# EAGLE design layer4 (EAGLE 9.6.2)

## Sheet 1 of 2: Sensors
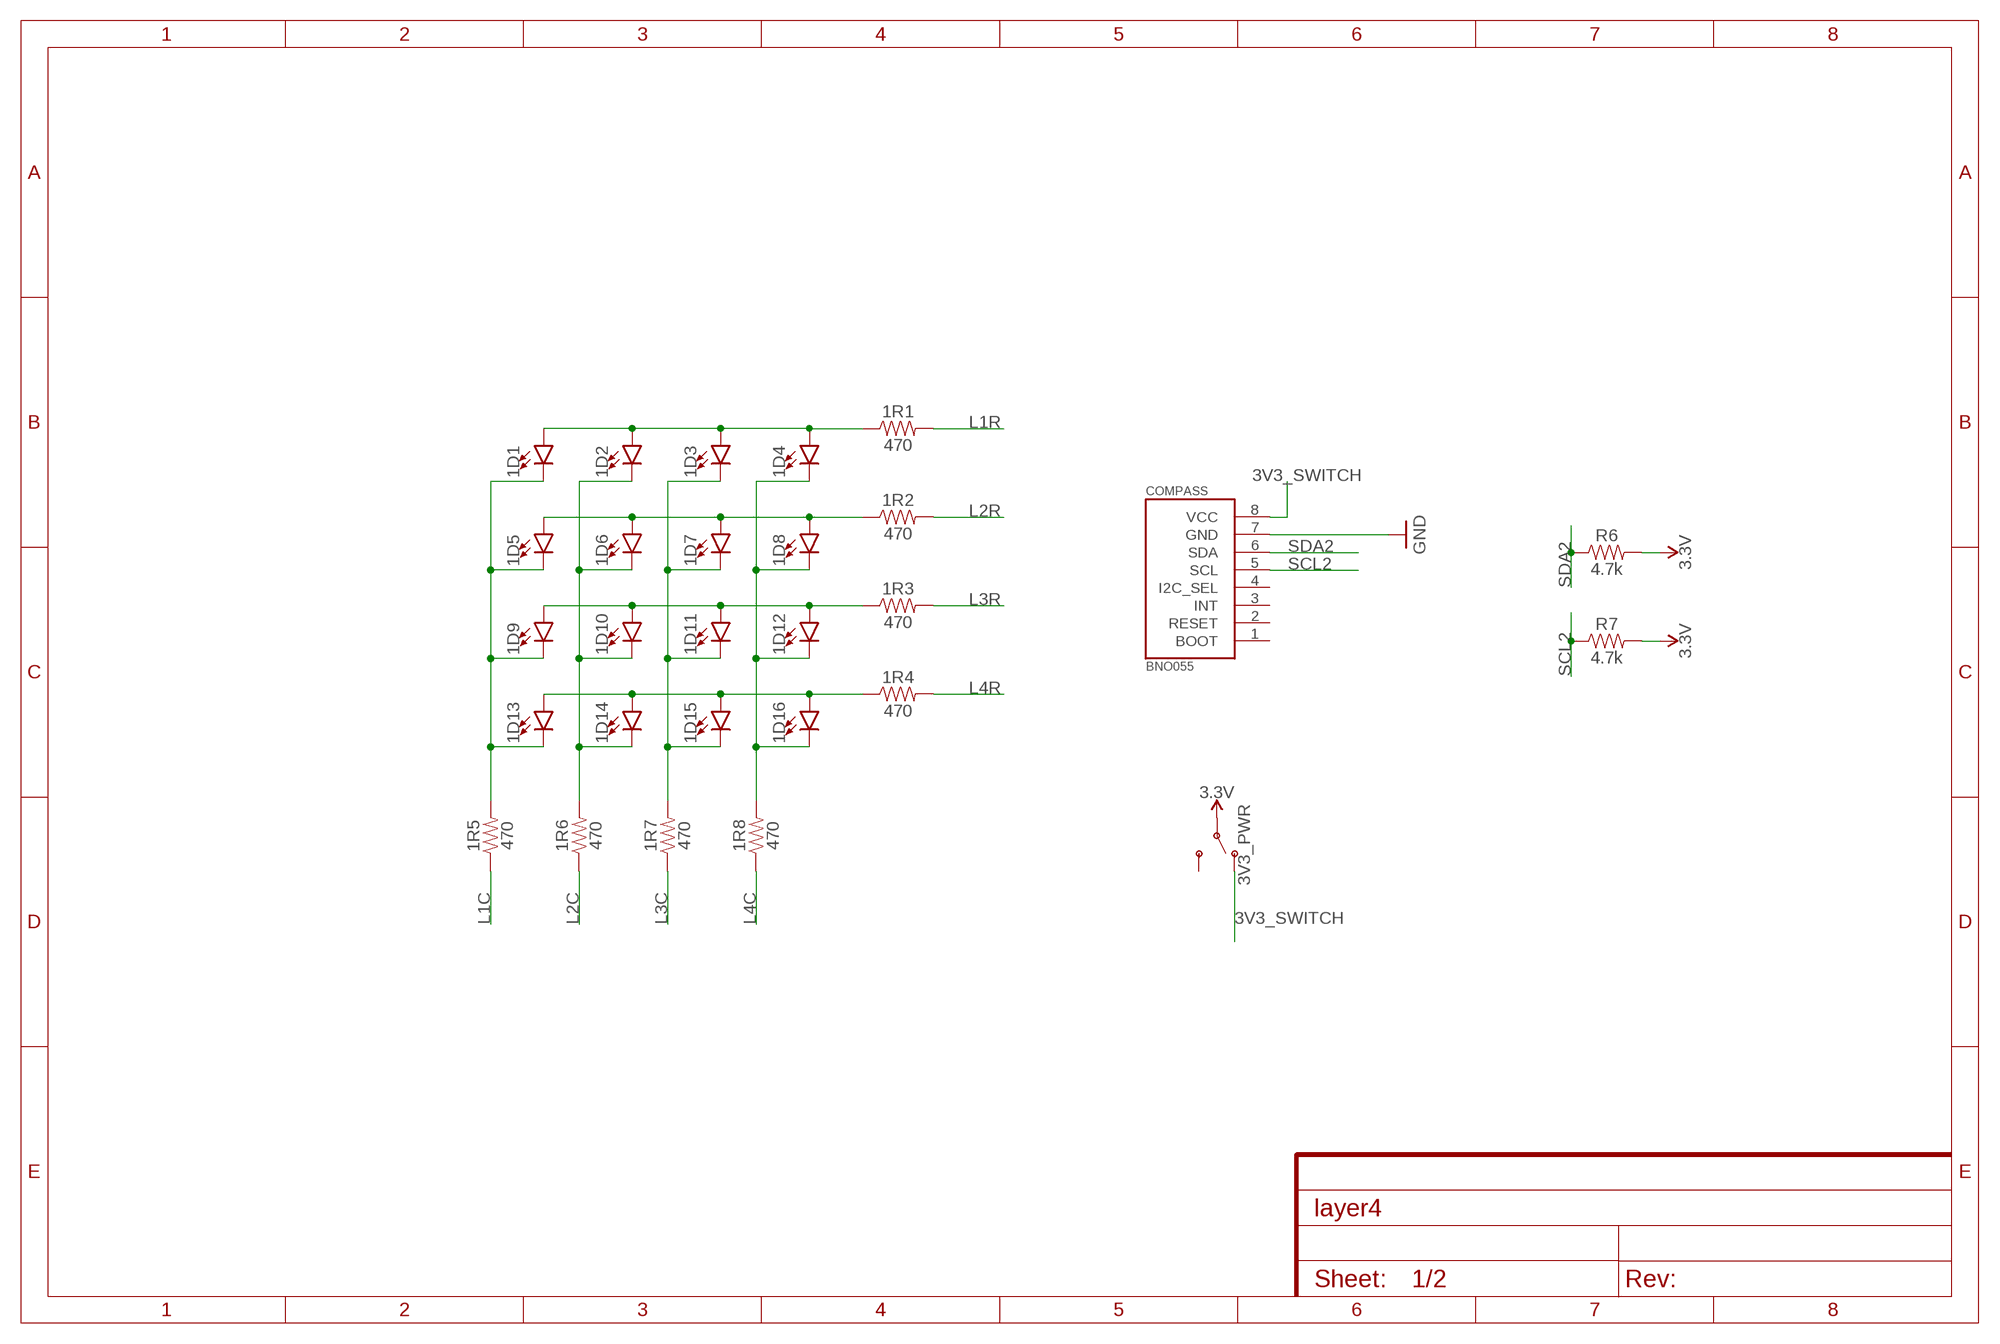
[diagram p0: schematic, sheet 1]

### Parts
1D1  LED0603  [LED-0603]
1D2  LED0603  [LED-0603]
1D3  LED0603  [LED-0603]
1D4  LED0603  [LED-0603]
1D5  LED0603  [LED-0603]
1D6  LED0603  [LED-0603]
1D7  LED0603  [LED-0603]
1D8  LED0603  [LED-0603]
1D9  LED0603  [LED-0603]
1D10  LED0603  [LED-0603]
1D11  LED0603  [LED-0603]
1D12  LED0603  [LED-0603]
1D13  LED0603  [LED-0603]
1D14  LED0603  [LED-0603]
1D15  LED0603  [LED-0603]
1D16  LED0603  [LED-0603]
1R1  470  RESISTOR0603  [R0603]
1R2  470  RESISTOR0603  [R0603]
1R3  470  RESISTOR0603  [R0603]
1R4  470  RESISTOR0603  [R0603]
1R5  470  RESISTOR0603  [R0603]
1R6  470  RESISTOR0603  [R0603]
1R7  470  RESISTOR0603  [R0603]
1R8  470  RESISTOR0603  [R0603]
3V3_PWR  SWITCH-SPDT-PTH-11.6X4.0MM-LOCK  [SWITCH_SPDT_PTH_11.6X4.0MM_LOCK]
COMPASS  BNO055  [BNO055]
R6  4.7k  4.7KOHM-0603-1/10W-1%  [0603]
R7  4.7k  4.7KOHM-0603-1/10W-1%  [0603]

### Nets
3.3V: 3V3_PWR.2(P) R6.2 R7.2 ; also sheet 2
3V3_SWITCH: 3V3_PWR.1(O) COMPASS.8(VCC) ; also sheet 2
GND: COMPASS.7(GND) ; also sheet 2
L1C: 1R5.1 ; also sheet 2
L1R: 1R1.2 ; also sheet 2
L2C: 1R6.1 ; also sheet 2
L2R: 1R2.2 ; also sheet 2
L3C: 1R7.1 ; also sheet 2
L3R: 1R3.2 ; also sheet 2
L4C: 1R8.1 ; also sheet 2
L4R: 1R4.2 ; also sheet 2
N$9: 1D1.A 1D2.A 1D3.A 1D4.A 1R1.1
N$11: 1D1.C 1D5.C 1D9.C 1D13.C 1R5.2
N$19: 1D5.A 1D6.A 1D7.A 1D8.A 1R2.1
N$20: 1D9.A 1D10.A 1D11.A 1D12.A 1R3.1
N$21: 1D13.A 1D14.A 1D15.A 1D16.A 1R4.1
N$22: 1D2.C 1D6.C 1D10.C 1D14.C 1R6.2
N$23: 1D3.C 1D7.C 1D11.C 1D15.C 1R7.2
N$24: 1D4.C 1D8.C 1D12.C 1D16.C 1R8.2
SCL2: COMPASS.5(SCL) R7.1 ; also sheet 2
SDA2: COMPASS.6(SDA) R6.1 ; also sheet 2
Unconnected: 3V3_PWR.3(S) COMPASS.1(BOOT) COMPASS.2(RESET) COMPASS.3(INT) COMPASS.4(I2C_SEL)

## Sheet 2 of 2: STEM32
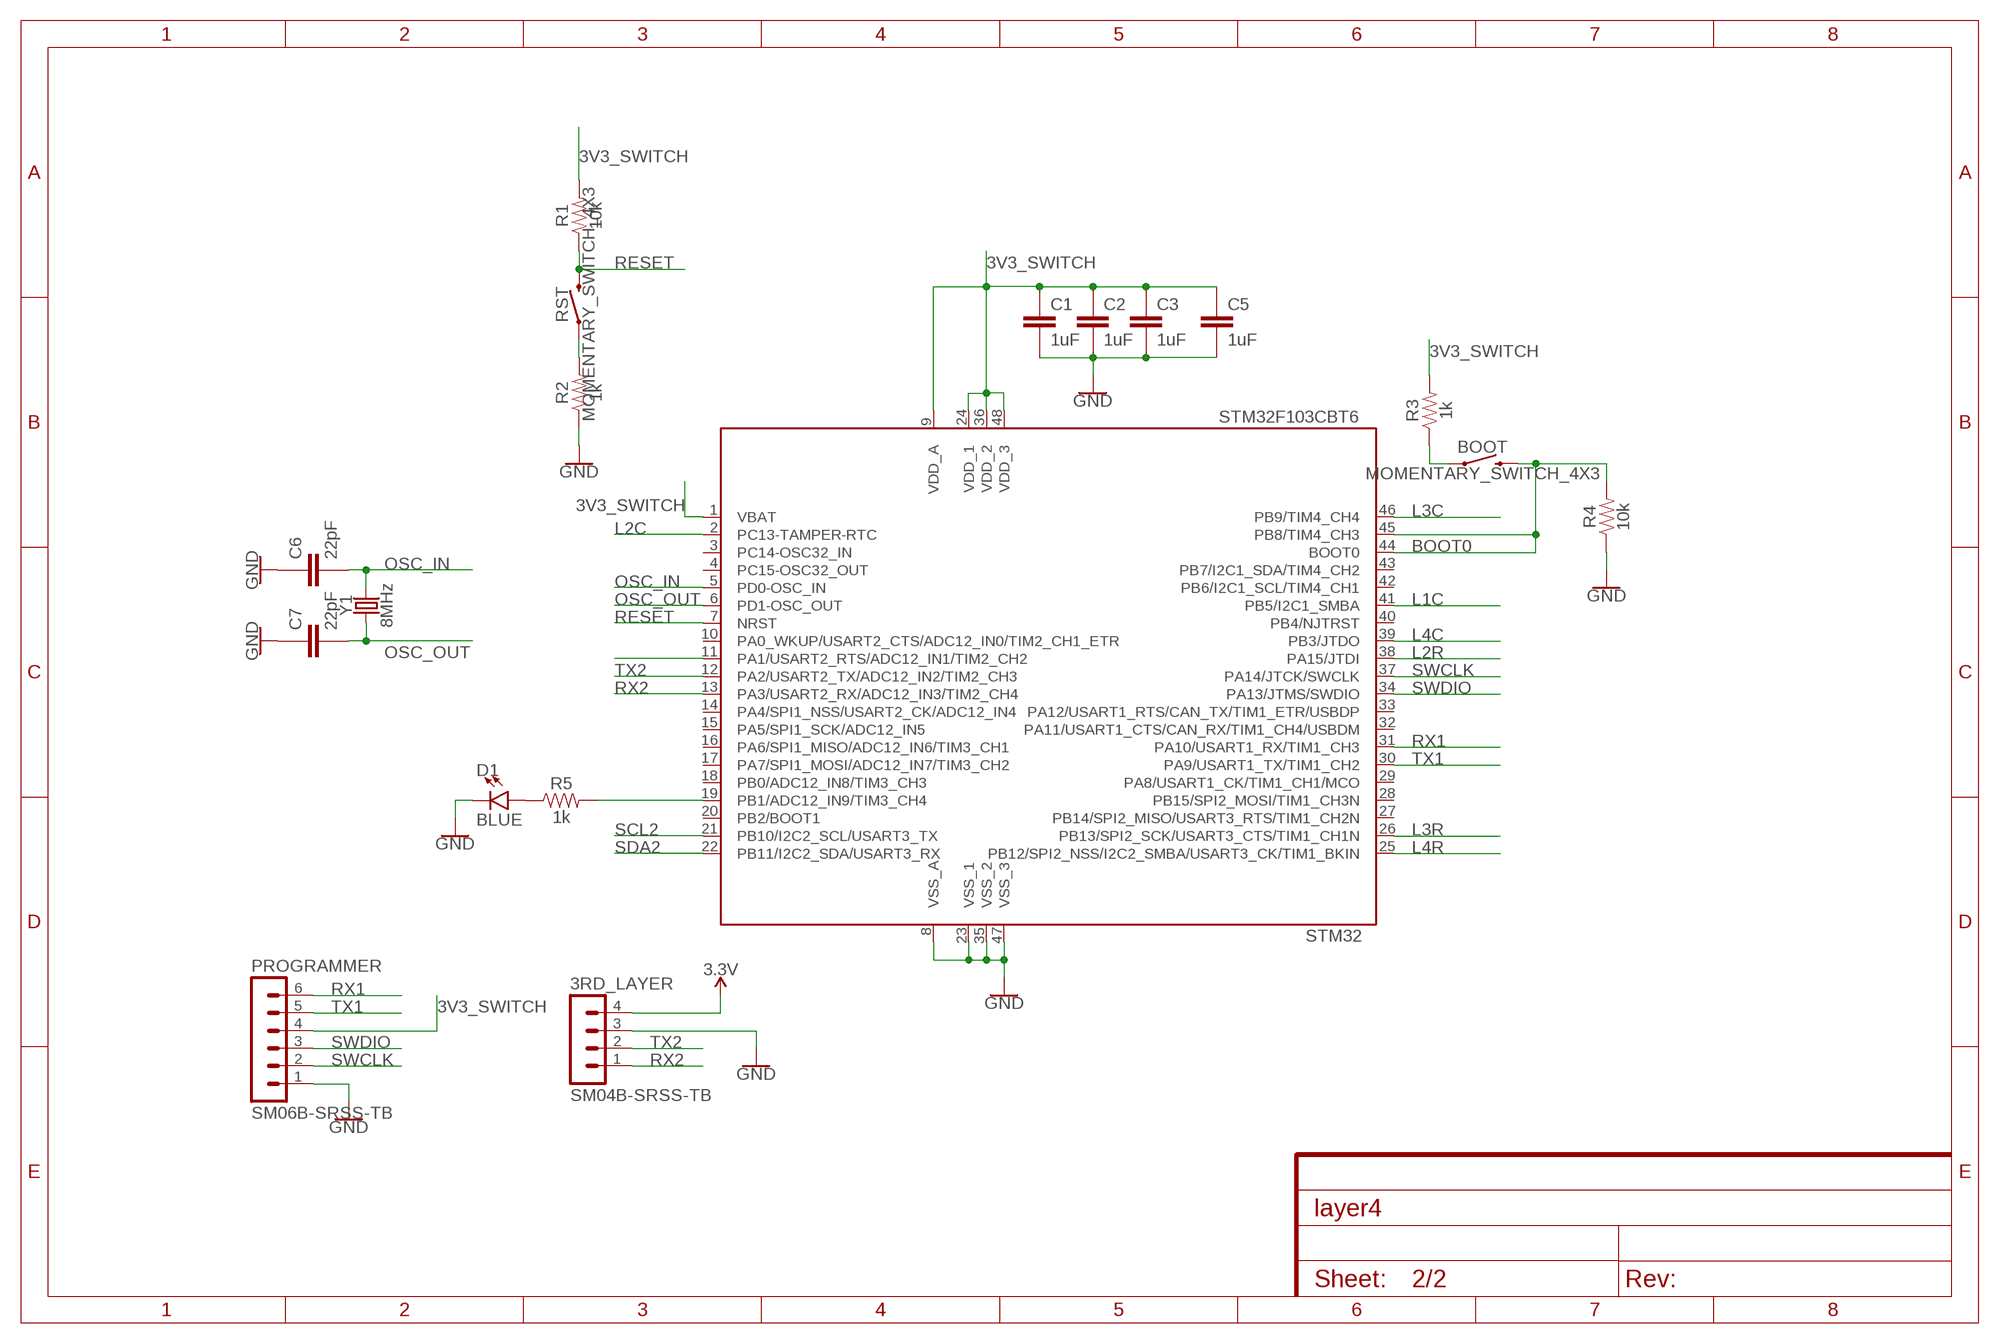
[diagram p1: schematic, sheet 2]

### Parts
3RD_LAYER  SM04B-SRSS-TB  [SM04B-SRSS-TB]
BOOT  MOMENTARY_SWITCH_4X3  [MOMENTARY_SWITCH_4X3]
C1  1uF  CAPACITOR0603  [C0603]
C2  1uF  CAPACITOR0603  [C0603]
C3  1uF  CAPACITOR0603  [C0603]
C5  1uF  CAPACITOR0603  [C0603]
C6  22pF  CAPACITOR0603  [C0603]
C7  22pF  CAPACITOR0603  [C0603]
D1  BLUE  LED0603  [LED-0603]
PROGRAMMER  SM06B-SRSS-TB  [SM06B-SRSS-TB]
R1  10k  RESISTOR0603  [R0603]
R2  1k  RESISTOR0603  [R0603]
R3  1k  RESISTOR0603  [R0603]
R4  10k  RESISTOR0603  [R0603]
R5  1k  RESISTOR0603  [R0603]
RST  MOMENTARY_SWITCH_4X3  [MOMENTARY_SWITCH_4X3]
STM32  STM32F103CBT6  [LQFP48]
Y1  8MHz  CRYSTALSMD-5X3.2-2PAD  [CRYSTAL-SMD-5X3.2-2PAD]

### Nets
3.3V: 3RD_LAYER.4 ; also sheet 1
3V3_SWITCH: C1.1 C2.1 C3.1 C5.2 PROGRAMMER.4 R1.2 R3.2 STM32.1(VBAT) STM32.9(VDD_A) STM32.24(VDD_1) STM32.36(VDD_2) STM32.48(VDD_3) ; also sheet 1
BOOT0: BOOT.P$2 R4.2 STM32.44(BOOT0) STM32.45(PB8/TIM4_CH3)
GND: 3RD_LAYER.3 C1.2 C2.2 C3.2 C5.1 C6.1 C7.1 D1.C PROGRAMMER.1 R2.1 R4.1 STM32.8(VSS_A) STM32.23(VSS_1) STM32.35(VSS_2) STM32.47(VSS_3) ; also sheet 1
L1C: STM32.41(PB5/I2C1_SMBA) ; also sheet 1
L1R: STM32.11(PA1/USART2_RTS/ADC12_IN1/TIM2_CH2) ; also sheet 1
L2C: STM32.2(PC13-TAMPER-RTC) ; also sheet 1
L2R: STM32.38(PA15/JTDI) ; also sheet 1
L3C: STM32.46(PB9/TIM4_CH4) ; also sheet 1
L3R: STM32.26(PB13/SPI2_SCK/USART3_CTS/TIM1_CH1N) ; also sheet 1
L4C: STM32.39(PB3/JTDO) ; also sheet 1
L4R: STM32.25(PB12/SPI2_NSS/I2C2_SMBA/USART3_CK/TIM1_BKIN) ; also sheet 1
N$70: R2.2 RST.P$1
N$72: BOOT.P$1 R3.1
N$73: R5.2 STM32.19(PB1/ADC12_IN9/TIM3_CH4)
N$74: D1.A R5.1
OSC_IN: C6.2 STM32.5(PD0-OSC_IN) Y1.P$2
OSC_OUT: C7.2 STM32.6(PD1-OSC_OUT) Y1.P$1
RESET: R1.1 RST.P$2 STM32.7(NRST)
RX1: PROGRAMMER.6 STM32.31(PA10/USART1_RX/TIM1_CH3)
RX2: 3RD_LAYER.1 STM32.13(PA3/USART2_RX/ADC12_IN3/TIM2_CH4)
SCL2: STM32.21(PB10/I2C2_SCL/USART3_TX) ; also sheet 1
SDA2: STM32.22(PB11/I2C2_SDA/USART3_RX) ; also sheet 1
SWCLK: PROGRAMMER.2 STM32.37(PA14/JTCK/SWCLK)
SWDIO: PROGRAMMER.3 STM32.34(PA13/JTMS/SWDIO)
TX1: PROGRAMMER.5 STM32.30(PA9/USART1_TX/TIM1_CH2)
TX2: 3RD_LAYER.2 STM32.12(PA2/USART2_TX/ADC12_IN2/TIM2_CH3)
Unconnected: STM32.3(PC14-OSC32_IN) STM32.4(PC15-OSC32_OUT) STM32.10(PA0_WKUP/USART2_CTS/ADC12_IN0/TIM2_CH1_ETR) STM32.14(PA4/SPI1_NSS/USART2_CK/ADC12_IN4) STM32.15(PA5/SPI1_SCK/ADC12_IN5) STM32.16(PA6/SPI1_MISO/ADC12_IN6/TIM3_CH1) STM32.17(PA7/SPI1_MOSI/ADC12_IN7/TIM3_CH2) STM32.18(PB0/ADC12_IN8/TIM3_CH3) STM32.20(PB2/BOOT1) STM32.27(PB14/SPI2_MISO/USART3_RTS/TIM1_CH2N) STM32.28(PB15/SPI2_MOSI/TIM1_CH3N) STM32.29(PA8/USART1_CK/TIM1_CH1/MCO) STM32.32(PA11/USART1_CTS/CAN_RX/TIM1_CH4/USBDM) STM32.33(PA12/USART1_RTS/CAN_TX/TIM1_ETR/USBDP) STM32.40(PB4/NJTRST) STM32.42(PB6/I2C1_SCL/TIM4_CH1) STM32.43(PB7/I2C1_SDA/TIM4_CH2)

## Library data of the parts
1D1-1D16 D1 = SparkFun-LED:LED: LED (Generic) Standard schematic elements and footprints for 5mm, 3mm, 1206, and 0603 sized LEDs. Generic LEDs with no color specified.
1R1-1R8 R1-R5 = JH:RESISTOR
3RD_LAYER = con-JST SH:SM04B-SRSS: JST SH series header 1.00mm pitch disconnectable crimp style connectors, horizontal (side entry type), 4 pins
3V3_PWR = SparkFun-Switches:SWITCH-SPDT: Single Pole, Double Throw (SPDT) Switch Single-pole, double-throw (SPDT) switch. Variant Overview SMD-AYZ0202 Surface Mount DPDT Switch <https://www.sparkfun.com/products/597> (COM-00597) Used on e.g. LilyPad Arduino USB - ATmega32U4 Board <https://www.sparkfun.com/products/12049> PTH-11.6X4.0MM SPDT Mini Power Switch <https://www.sparkfun.com/products/102> (COM-00102) Used on e.g. SparkFun Simon Says - Through-Hole Soldering Kit <https://www.sparkfun.com/products/10547> (KIT-10547) PTH-11.6X4.0MM-KIT KIT version of SPDT Mini Power Switch - Simplifies soldering by removing tStop of switch pins - only one side can be soldered. PTH-11.6X4.0MM-LOCK LOCK version of SPDT Mini Power Switch - Offset pins hold switch in place for easier soldering. SMD-RIGHT-ANGLE Surface Mount Right Angle Switch <https://www.sparkfun.com/products/10860> (COM-10860) Used on e.g. SparkFun ESP8266 Thing <https://www.sparkfun.com/products/13231>; PROD_ID: SWCH-08261; SF_SKU: COM-00102
BOOT RST = MY-LIBRARY:MOMENTARY_SWITCH_4X3
C1-C3 C5-C7 = JH:CAPACITOR
COMPASS = JH:BNO055
PROGRAMMER = con-JST SH:SM06B-SRSS: JST SH series header 1.00mm pitch disconnectable crimp style connectors, horizontal (side entry type), 6 pins
R6 R7 = SparkFun-Resistors:4.7KOHM: 4.7kΩ resistor A resistor is a passive two-terminal electrical component that implements electrical resistance as a circuit element. Resistors act to reduce current flow, and, at the same time, act to lower voltage levels within circuits. - Wikipedia; PROD_ID: RES-07857
STM32 = JH:STM32F103CBT6
Y1 = SparkFun-Clocks:CRYSTAL: Crystals (Generic) These are passive quartz crystals, which can be used as a clock source for a microcontroller. Crystal's are two-terminal devices. They require external "load" capacitors to generate an oscillating signal.

## Board
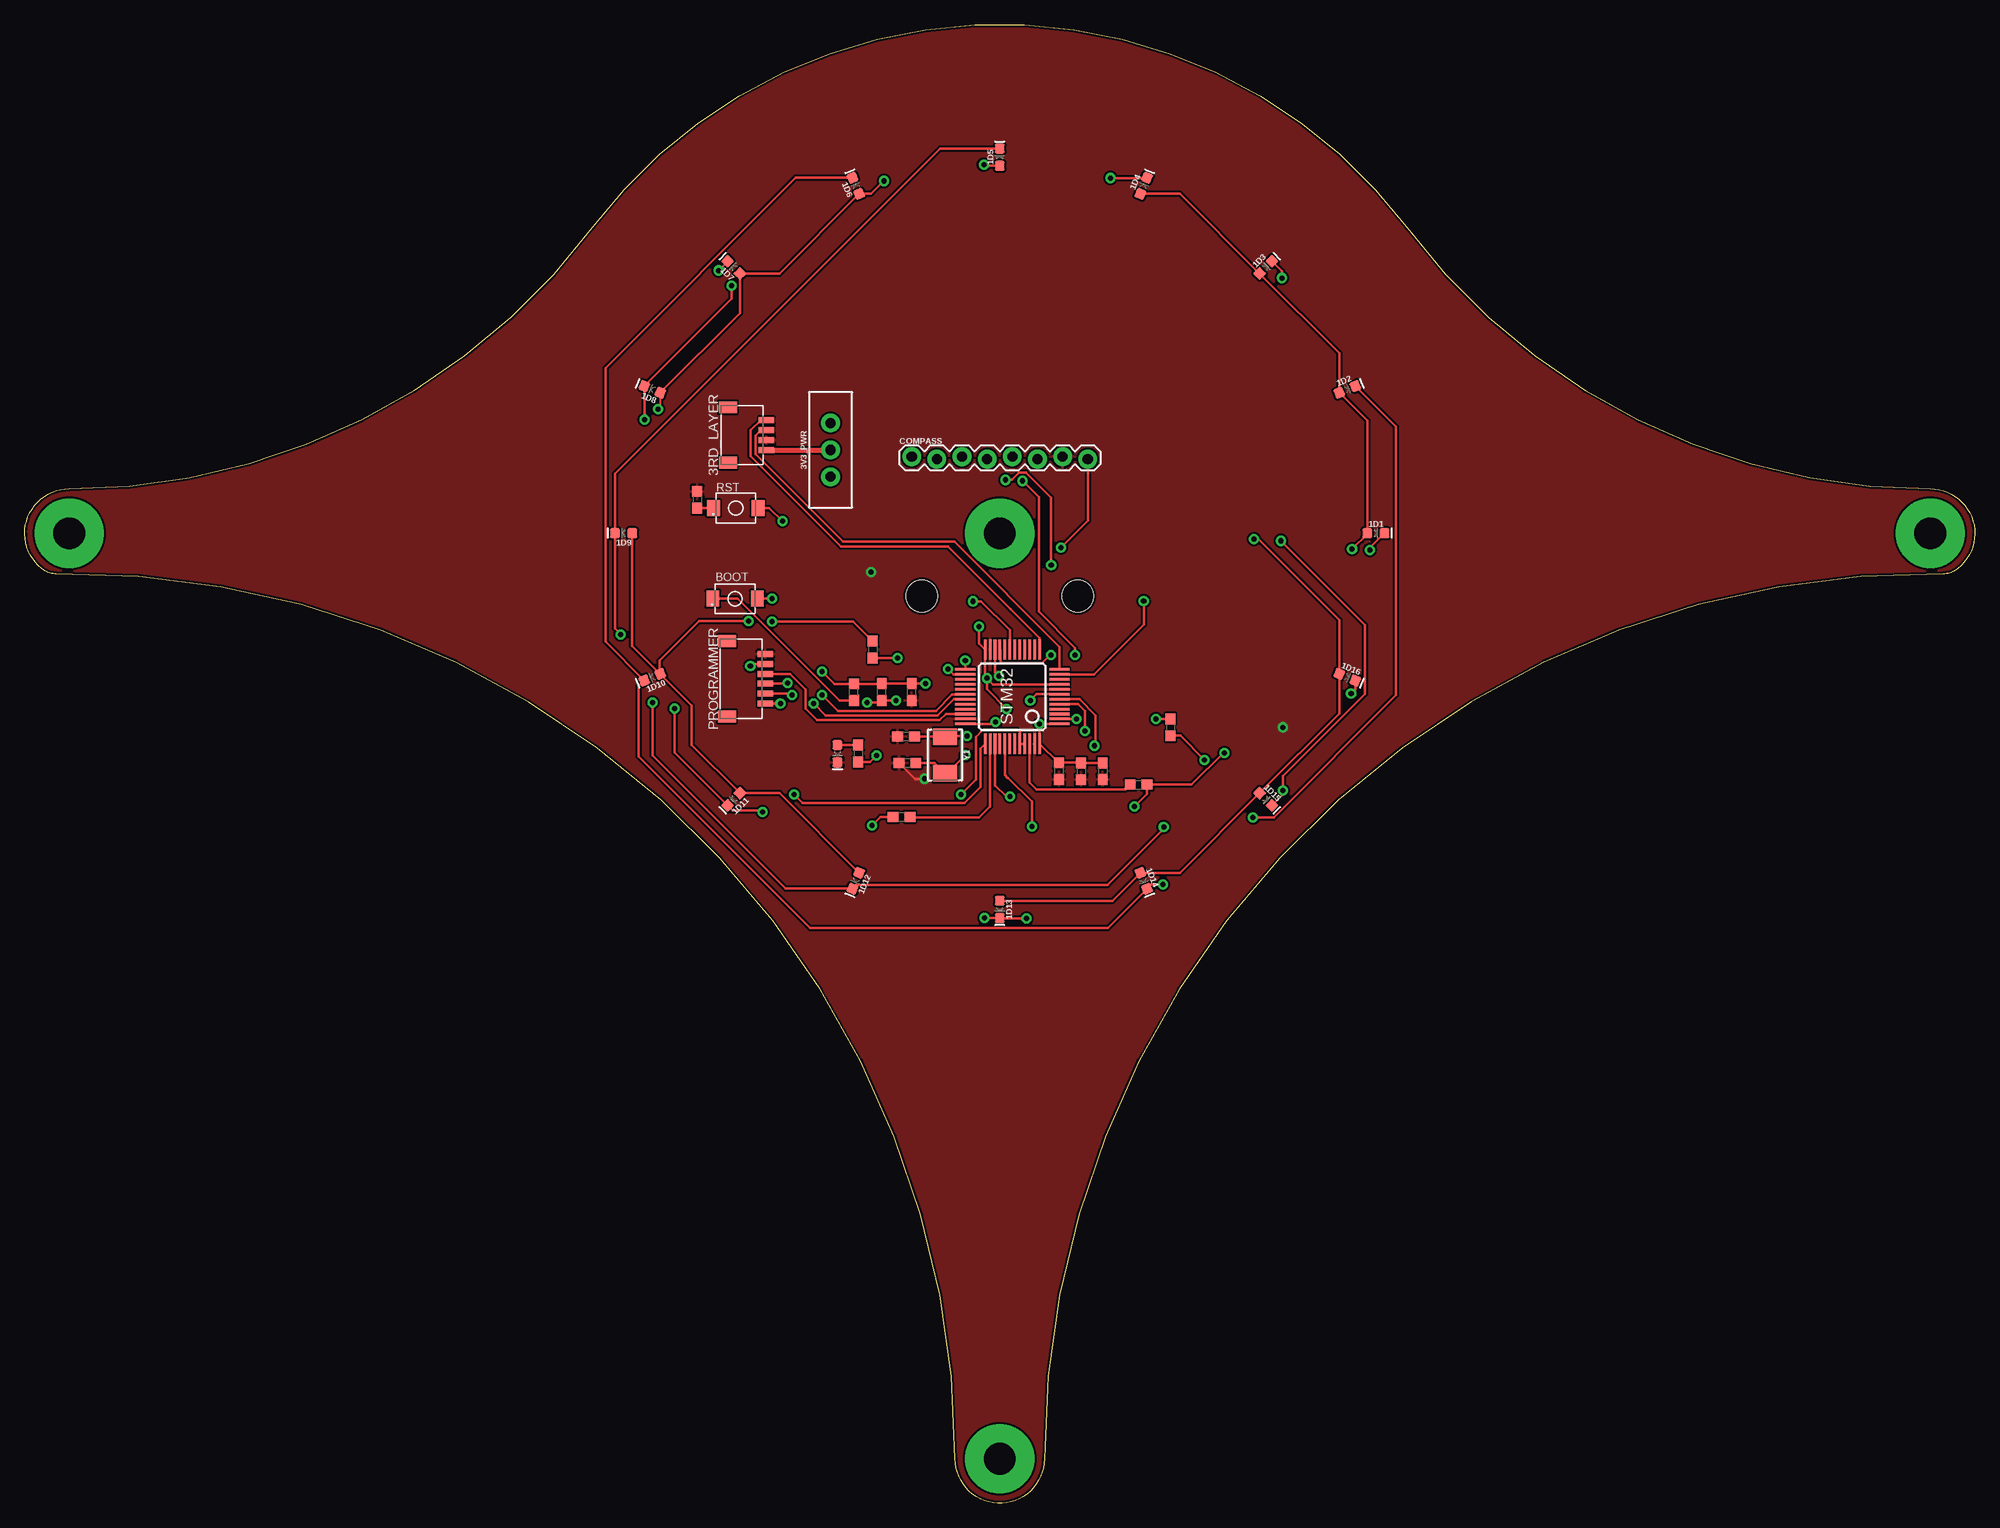
[diagram p2: board, top side]
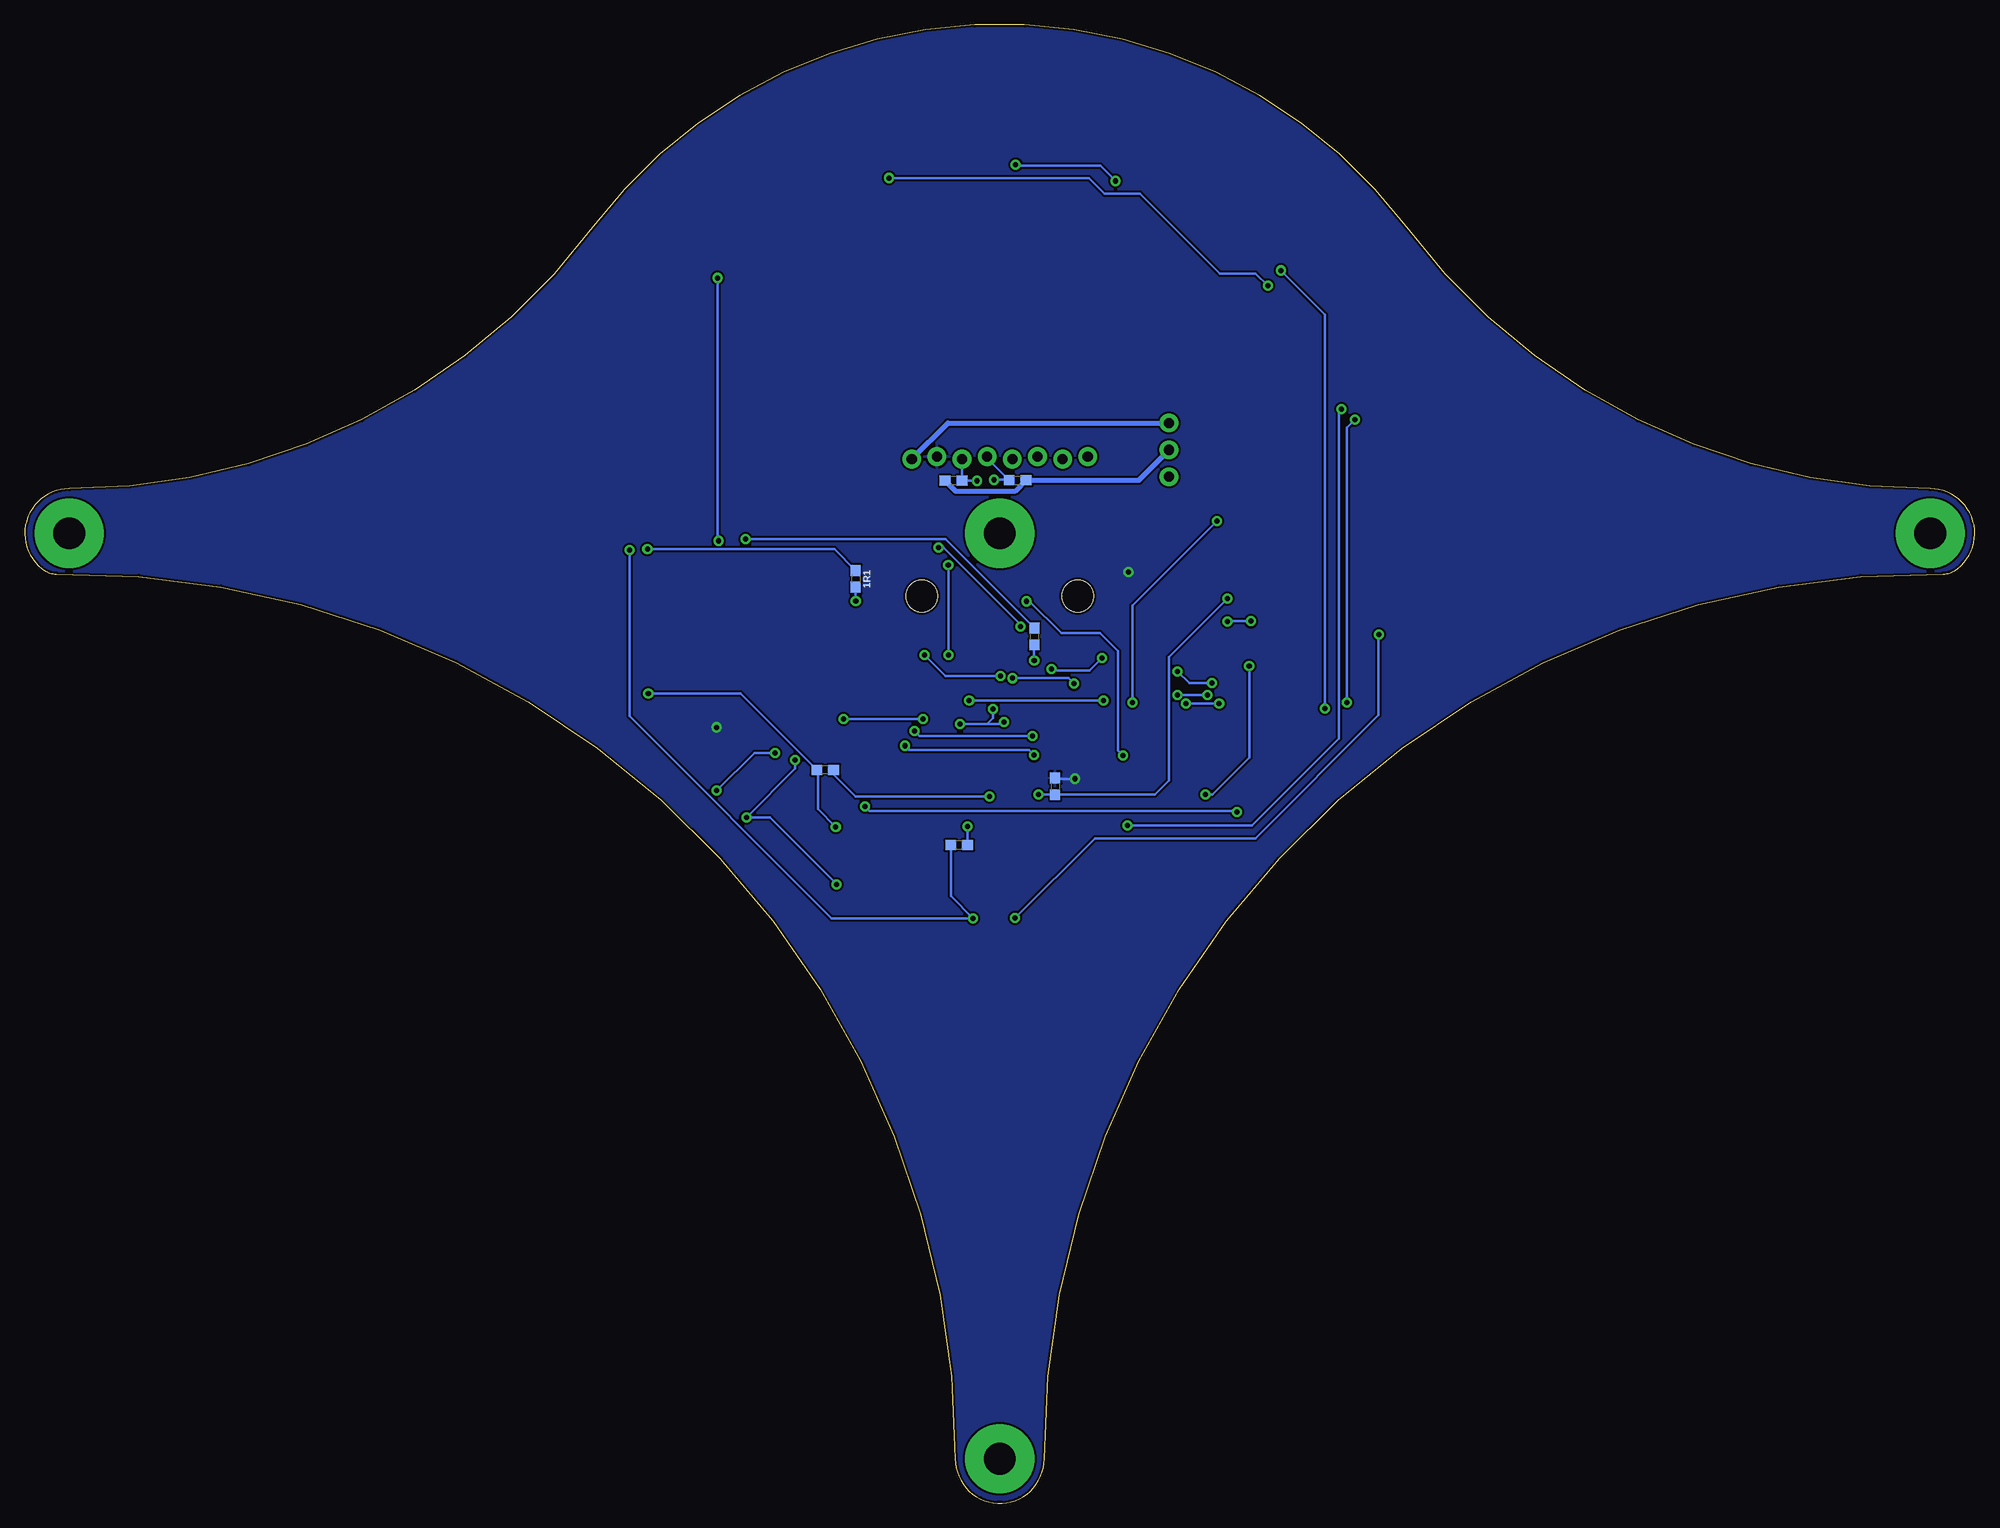
[diagram p3: board, bottom side, seen from below]

Size 197 x 149.37 mm. Coordinates in mm from the lower left corner, seen from the top.
Outline: 3.19,93.88 arc-33 2.09,94.19 arc-148 4.5,102.49 arc53 57.38,128.9 arc-106 139.62,128.9 arc53 192.5,102.49 arc-148 194.91,94.19 arc-33 193.81,93.88 arc91 103,4.47 arc-179 94,4.47 arc91 3.19,93.88
Copper layers (1*16): Top 0.035mm / dielectric 1.5mm / Bottom 0.035mm
Design rules "SparkFun": minimum track width 8mil, minimum drill 20mil, track to track 8mil, track to pad 8mil, pad to pad 8mil, via to via 8mil, smd to smd 8mil, copper to edge 10mil, drill to drill 8mil, minimum pad ring 12mil, minimum via ring 10mil, stop-mask expansion 4mil, vias tented up to drill 25mil, thermal gap 10mil
tKeepout: area 87.1,88.1 to 94.2,95.2; area 102.8,88.1 to 109.9,95.2

### Footprints (pad centres in the part's own frame; a part is rotated, then mirrored left to right if it is on the bottom)
LED-0603 = smd 1 x 1: A -0.877,0; C 0.877,0
R0603 = smd 1.1 x 1: 1 -0.85,0; 2 0.85,0
SM04B-SRSS-TB = smd 0.6 x 1.55: 1 1.5,0; 2 0.5,0; 3 -0.5,0; 4 -1.5,0 | smd 1.2 x 1.8: M1 2.8,3.875; M2 -2.8,3.875
SWITCH_SPDT_PTH_11.6X4.0MM_LOCK = drill 1.016 pad 1.88: 1 0,2.718; 2 0,0; 3 0,-2.718
MOMENTARY_SWITCH_4X3 = smd 1.3 x 1.6: P$1 -2.25,0; P$2 2.25,0
C0603 = smd 1.1 x 1: 1 -0.85,0; 2 0.85,0
BNO055 = drill 1.016 pad 1.88: 1 -8.89,14.097; 2 -6.35,13.843; 3 -3.81,14.097; 4 -1.27,13.843; 5 1.27,14.097; 6 3.81,13.843; 7 6.35,14.097; 8 8.89,13.843 | hole 3.2: -7.874,0; 7.874,0
SM06B-SRSS-TB = smd 0.6 x 1.55: 1 2.5,0; 2 1.5,0; 3 0.5,0; 4 -0.5,0; 5 -1.5,0; 6 -2.5,0 | smd 1.2 x 1.8: M1 3.8,3.875; M2 -3.8,3.875
0603 = smd 1.1 x 1: 1 -0.85,0; 2 0.85,0
LQFP48 = smd 0.254 x 2.032: 1 -2.75,-4.758; 2 -2.25,-4.758; 3 -1.75,-4.758; 4 -1.25,-4.758; 5 -0.75,-4.758; 6 -0.25,-4.758; 7 0.25,-4.758; 8 0.75,-4.758; 9 1.25,-4.758; 10 1.75,-4.758; 11 2.25,-4.758; 12 2.75,-4.758; 25 2.75,4.758; 26 2.25,4.758; 27 1.75,4.758; 28 1.25,4.758; 29 0.75,4.758; 30 0.25,4.758; 31 -0.25,4.758; 32 -0.75,4.758; 33 -1.25,4.758; 34 -1.75,4.758; 35 -2.25,4.758; 36 -2.75,4.758 | smd 2.032 x 0.254: 13 4.758,-2.75; 14 4.758,-2.25; 15 4.758,-1.75; 16 4.758,-1.25; 17 4.758,-0.75; 18 4.758,-0.25; 19 4.758,0.25; 20 4.758,0.75; 21 4.758,1.25; 22 4.758,1.75; 23 4.758,2.25; 24 4.758,2.75; 37 -4.758,2.75; 38 -4.758,2.25; 39 -4.758,1.75; 40 -4.758,1.25; 41 -4.758,0.75; 42 -4.758,0.25; 43 -4.758,-0.25; 44 -4.758,-0.75; 45 -4.758,-1.25; 46 -4.758,-1.75; 47 -4.758,-2.25; 48 -4.758,-2.75
CRYSTAL-SMD-5X3.2-2PAD = smd 1.7 x 2.4: P$1 1.85,0; P$2 -1.85,0

### Placement (x,y rotation side)
1D1  136.5,97.99 0 top
1D2  133.61,112.54 22.5 top
1D3  125.37,124.86 45 top
1D4  113.04,133.1 67.5 top
1D5  98.5,135.99 90 top
1D6  83.96,133.1 112.5 top
1D7  71.63,124.86 135 top
1D8  63.39,112.54 157.5 top
1D9  60.5,97.99 180 top
1D10  63.39,83.45 202.5 top
1D11  71.63,71.12 225 top
1D12  83.96,62.89 247.5 top
1D13  98.5,59.99 270 top
1D14  113.04,62.89 292.5 top
1D15  125.37,71.12 315 top
1D16  133.61,83.45 337.5 top
1R1  113.05,93.39 270 bottom
1R2  88.57,69.35 0 top
1R3  85.67,86.25 270 top
1R4  95.01,87.58 270 bottom
1R5  102.6,66.49 180 bottom
1R6  115.74,78.39 270 top
1R7  112.53,72.59 0 top
1R8  116.13,74.08 180 bottom
3RD_LAYER  74.91,107.92 90 top
3V3_PWR  81.4,106.42 0 top
BOOT  71.76,91.39 0 top
C1  108.9,73.95 270 top
C2  106.72,73.94 270 top
C3  104.47,73.96 270 top
C5  89.61,81.96 90 top
C6  89.04,77.46 0 top
C7  89.17,74.79 0 top
COMPASS  98.5,91.64 0 top
D1  82.11,75.73 270 top
PROGRAMMER  74.81,83.29 90 top
R1  86.58,81.95 90 top
R2  67.93,101.38 270 top
R3  83.77,81.94 90 top
R4  92.9,72.43 270 bottom
R5  84.19,75.75 270 top
R6  103.17,103.31 180 bottom
R7  96.69,103.35 0 bottom
RST  71.82,100.54 0 top
STM32  99.77,81.48 90 top
Y1  92.97,75.59 270 top

### Tracks (layer width: path | path; a pad name or v marks a point on that pad's centre or on a via)
3.3V
  Top 0.508: 3RD_LAYER.4 3V3_PWR.2
  Bottom 0.508: 3V3_PWR.2 81.4,106.38 84.43,103.35 R7.2 96.96,102.23 102.93,102.23 R6.2
3V3_SWITCH  (via drill 0.51)
  Top 0.254: C1.1 C2.1 106.7,74.81 C3.1 104.43,74.81 STM32.48 v102.52,78.73 STM32.1 | v97.2,83.35 97.03,83.51 97.03,86.23 STM32.24 96.39,86.87 v96.39,88.59 | v98.06,78.95 97.85,78.73 STM32.36 | v91,82.79 v90.99,82.81 C5.2 R1.2 86.56,82.79 R3.2 81.8,82.79 v80.55,84.04 | PROGRAMMER.4 77,82.79 v77.06,82.85 | v99.2,80.26 97.2,82.26 v97.2,83.35 | v104.7,96.56 107.39,99.25 COMPASS.8 | v97.2,83.35 97.81,82.73 STM32.9
  Bottom 0.254: 99.8,78.73 98.27,78.73 v98.06,78.95 | 99.8,78.73 v102.52,78.73 | v91,82.79 91.55,83.35 v97.2,83.35 | v77.06,82.85 79.35,82.85 v80.55,84.04 | 99.8,78.73 99.2,79.33 v99.2,80.26 | v104.7,96.56 104.18,96.56 96.39,88.78 v96.39,88.59
  Bottom 0.508: COMPASS.8 103.74,109.14 3V3_PWR.1
BOOT0  (via drill 0.51)
  Top 0.254: STM32.45 STM32.44 100.52,77.86 100.27,78.1 96.77,78.1 96.1,77.43 96.1,73.1 v94.6,71.6 | v75.49,91.39 BOOT.P$2
  Bottom 0.254: v75.49,91.39 81.38,85.49 81.38,73.03 82.83,71.58 R4.2 92.91,71.6 v94.6,71.6
GND  (via drill 0.51)
  Top 0.254: C7.1 89.92,73.19 v90.9,73.19
  Bottom 0.254: v90.9,73.19 92.81,73.19 R4.1
  other vias: 127.1,78.39 85.5,94.09
  pour Top: -5.8,150.29 -5.8,-4.21 199.2,-4.21 199.2,150.29
  pour Bottom: -5.9,150.39 -5.9,-4.41 199.2,-4.41 199.2,150.39
L1C  (via drill 0.51)
  Top 0.254: STM32.41 99.02,73.57 99.3,73.29 99.35,73.29 101.74,70.9 v101.74,68.36
  Bottom 0.254: v101.74,68.36 v101.75,68.35 1R5.1
L1R  (via drill 0.51)
  Top 0.254: STM32.11 108.02,83.73 113.05,88.76 113.05,91.16 v113.04,91.17
  Bottom 0.254: v113.04,91.17 v113.05,91.17 1R1.2
L2C  (via drill 0.51)
  Top 0.254: v106.26,79.22 v106.25,79.23 STM32.2 | v114.29,79.21 114.32,79.24 1R6.1
  Bottom 0.254: v106.26,79.22 114.27,79.22 v114.29,79.21
L2R
  Top 0.254: STM32.38 97.53,70.41 96.42,69.3 89.47,69.3 1R2.2
L3C
  Top 0.254: STM32.46 101.52,72.81 102.22,72.11 111.2,72.11 1R7.1
L3R  (via drill 0.51)
  Top 0.254: 1R3.2 88.17,85.4 v88.19,85.37 | v93.27,84.29 93.82,83.73 STM32.26
  Bottom 0.254: v88.19,85.37 89.45,84.11 93.09,84.11 v93.27,84.29
L4C  (via drill 0.51)
  Top 0.254: STM32.39 98.03,72.53 99.17,71.39 v99.54,71.39
  Bottom 0.254: v99.54,71.39 113.06,71.39 115.28,73.61 1R8.1
L4R  (via drill 0.51)
  Top 0.254: v95.02,85.16 STM32.25
  Bottom 0.254: 1R4.2 v95.02,85.16
N$1  (via drill 3.2 pad 7)
  other vias: 192.5,97.99
N$2  (via drill 3.2 pad 7)
  other vias: 4.5,97.99
N$3  (via drill 3.2 pad 7)
  other vias: 98.5,4.49
N$6  (via drill 3.2 pad 7)
  other vias: 98.5,97.99
N$9  (via drill 0.51)
  Top 0.254: 1D4.A 116.7,132.29 1D3.A 132.8,116.2 1D2.A 135.62,109.38 1D1.A 135.62,97.92 v134.1,96.39
  Bottom 0.254: 1R1.1 115.2,96.39 v134.1,96.39
N$11  (via drill 0.51)
  Top 0.254: 1D5.C 92.48,136.87 59.62,104.02 1D9.C 59.62,88.35 v60.2,87.78 | v101.2,59.09 98.52,59.09 1D13.C v96.97,59.12 | v135.91,96.31 135.91,96.53 1D1.C
  Bottom 0.254: v96.97,59.12 88.9,67.18 72.66,67.18 60.23,79.62 60.23,87.75 v60.2,87.78 | 1R5.2 103.45,61.34 v101.2,59.09 115.49,59.09 135.91,79.52 v135.91,96.31
N$19  (via drill 0.51)
  Top 0.203: 1D8.A 64.2,110.73 v64,110.53
  Top 0.254: 1D8.A 72.25,120.25 1D7.A 76.25,124.24 1D6.A 85.5,132.29 v86.8,133.59 | 1R2.1 87.71,69.36 86.47,69.36 v85.6,68.48 | v96.89,135.23 97,135.12 1D5.A
  Bottom 0.254: v86.8,133.59 88.32,135.12 96.78,135.12 v96.89,135.23 | v85.6,68.48 73.01,68.48 64.26,77.24 64.26,110.27 v64,110.53
N$20  (via drill 0.51)
  Top 0.254: 1D12.A 76.25,71.74 1D11.A 67.37,76.62 67.37,80.62 1D10.A 64.15,83.84 | 1D9.A 61.38,86.61 64.15,83.84 | 64.15,83.84 64.15,85.15 68.11,89.11 v73.11,89.11 | v75.5,89.09 83.67,89.09 1R3.1
  Bottom 0.254: v73.11,89.11 75.48,89.11 v75.5,89.09
N$21  (via drill 0.51)
  Top 0.254: 1D13.A 109.88,60.87 1D14.A 116.7,63.7 1D15.A 132.8,79.79 1D16.A 132.8,89.23 124.63,97.4 v124.16,97.4
  Bottom 0.254: v124.16,97.4 103.98,97.4 1R4.1
N$22  (via drill 0.51)
  Top 0.254: 1D6.C 77.9,133.91 58.66,114.68 58.66,87.04 1D10.C 62.01,82.55 62.01,75.46 79.35,58.12 109.42,58.12 1D14.C 113.79,62.49 v115,62.49 | 1D2.C 138.52,108.77 138.52,81.64 126.18,69.29 v124.1,69.29 | 1R6.2 116.75,77.54 v119.19,75.11
  Bottom 0.254: v115,62.49 115,62.58 121.71,69.29 v124.1,69.29 119.19,74.21 v119.19,75.11
N$23  (via drill 0.51)
  Top 0.254: v65.64,80.29 65.64,75.87 1D11.C 71.5,70.01 74.34,70.01 v74.53,69.82 | 1D15.C 127.1,71.61 v127.1,71.99 127.1,73.45 135.39,81.74 135.39,88.74 v126.9,97.23 | v127,123.79 127,124.47 1D3.C | v70.11,124.55 71.01,125.45 1D7.C | v112.1,70.39 113.38,71.67 1R7.2 117.89,72.59 121.09,75.8 v121.19,75.8
  Bottom 0.254: v74.53,69.82 74.66,69.94 111.65,69.94 v112.1,70.39 | v65.64,80.29 65.64,120.09 v70.11,124.55 | v126.9,97.23 127,97.33 v127,123.79 | v121.19,75.8 123.29,75.8 v127.1,71.99
N$24  (via drill 0.51)
  Top 0.254: v109.7,133.89 113.36,133.89 1D4.C | v134,81.79 134.42,82.22 1D16.C | v63.42,80.89 63.42,75.54 76.87,62.09 83.6,62.09 1D12.C 84.03,62.49 109.38,62.49 115.07,68.18 v115.07,68.33 | v62.6,109.49 62.6,112.85 1D8.C 71.41,121.7 v71.41,122.99
  Bottom 0.254: v115.07,68.33 116.87,70.13 116.87,73.97 1R8.2 124.69,81.79 v134,81.79 | v63.42,80.89 63.42,108.67 v62.6,109.49 | v71.41,122.99 72.66,124.24 76.25,124.24 84.31,132.3 87.91,132.3 89.5,133.89 v109.7,133.89
N$70
  Top 0.254: R2.2 RST.P$1
N$72
  Top 0.254: R3.1 82.32,81.09 72.02,91.39 BOOT.P$1
N$73  (via drill 0.51)
  Top 0.254: STM32.19 99.51,88.2 96.59,91.12 v95.79,91.12 | R5.2 85.41,74.9 v86.04,75.53
  Bottom 0.254: v86.04,75.53 86.55,76.04 86.55,86.1 88.35,87.89 92.26,87.89 95.49,91.12 v95.79,91.12
N$74
  Top 0.254: D1.A R5.1
OSC_IN  (via drill 0.51)
  Top 0.254: STM32.5 106.38,80.73 107.1,80.02 v107.1,78.03 | Y1.P$2 92.99,77.46 | v95.2,77.49 93.02,77.49 92.99,77.46 | C6.2 92.99,77.46
  Bottom 0.254: v95.2,77.49 106.59,77.49 107.1,78.01 v107.1,78.03
OSC_OUT  (via drill 0.51)
  Top 0.254: STM32.6 106.54,81.23 108.19,79.59 108.19,76.64 v108.08,76.53 | v95.02,75.57 93.19,73.74 Y1.P$1 91.92,74.79 C7.2
  Bottom 0.254: v108.08,76.53 107.65,76.1 95.52,76.1 95.02,75.6 v95.02,75.57
RESET  (via drill 0.51)
  Top 0.254: RST.P$2 75.21,100.54 v76.54,99.21 | v85.08,80.89 86.37,80.89 R1.1 v87.99,81.1 v88,81.09 | STM32.7 102.23,81.73 101.59,81.09 v101.58,81.09
  Bottom 0.254: v76.54,99.21 85.08,90.68 v85.08,80.89 | v88,81.09 v101.58,81.09
RX1  (via drill 0.51)
  Top 0.254: STM32.31 93.87,81.23 92.24,79.6 80.92,79.6 79.72,80.79 v79.7,80.79 | v76.33,80.78 74.82,80.78 PROGRAMMER.6
  Bottom 0.254: v79.7,80.79 v79.69,80.78 v76.33,80.78
RX2
  Top 0.254: STM32.13 102.53,87.4 99.57,90.36 | 3RD_LAYER.1 74.37,109.42 73.35,108.4 73.35,105.79 82.47,96.68 93.26,96.68 99.57,90.36 | 99.57,90.36
SCL2  (via drill 0.51)
  Top 0.254: STM32.21 98.56,86.2 98.56,85.09 98.76,84.9 102.78,84.9 103.58,85.69 v103.69,85.69 | v103.7,94.79 103.7,101.58 101.15,104.13 100.45,104.13 99.71,103.39 v99.1,103.39
  Bottom 0.254: COMPASS.5 99.77,105.58 R7.1 97.58,103.39 v99.1,103.39 | v103.69,85.69 v103.69,94.79 v103.7,94.79
SDA2  (via drill 0.51)
  Top 0.254: v106.1,85.69 106.1,86.41 102.44,90.07 102.44,101.65 v100.8,103.29 | STM32.22 98.02,83.94 98.39,83.57 v98.42,83.57
  Bottom 0.254: COMPASS.6 102.32,105.48 R6.1 100.82,103.31 v100.8,103.29 | v106.1,85.69 103.98,83.57 v98.42,83.57
SWCLK  (via drill 0.51)
  Top 0.254: STM32.37 96.56,76.26 96.56,72.37 94.95,70.76 78.56,70.76 v77.7,71.62 | v73.3,84.59 73.5,84.79 PROGRAMMER.2
  Bottom 0.254: v73.3,84.59 | v73.3,84.59 73.3,75.34 77.02,71.62 v77.7,71.62
SWDIO
  Top 0.254: STM32.34 93.05,79.73 92.44,79.12 80.03,79.12 78.86,80.29 78.86,82.23 77.3,83.79 PROGRAMMER.3
TX1  (via drill 0.51)
  Top 0.254: STM32.30 94.97,81.69 93.69,81.69 92.05,80.05 82.17,80.05 v80.55,81.67 | PROGRAMMER.5 77.34,81.79 v77.5,81.63
  Bottom 0.254: v77.5,81.63 80.51,81.63 v80.55,81.67
TX2
  Top 0.254: STM32.12 104.53,86.53 93.92,97.13 82.66,97.13 73.81,105.98 73.81,107.86 74.37,108.42 3RD_LAYER.2